# Altium schematic sheet power.SchDoc
size Tabloid; Author: Martin Lafleur; Organization: Opensolar; Address1: 125 Du Versant; Address2: Saint-Colomban; Address3: Québec, Canada; Address4: J5K 1L9; Website: www.opensolar.io; email: mlafleur@opensolar.io
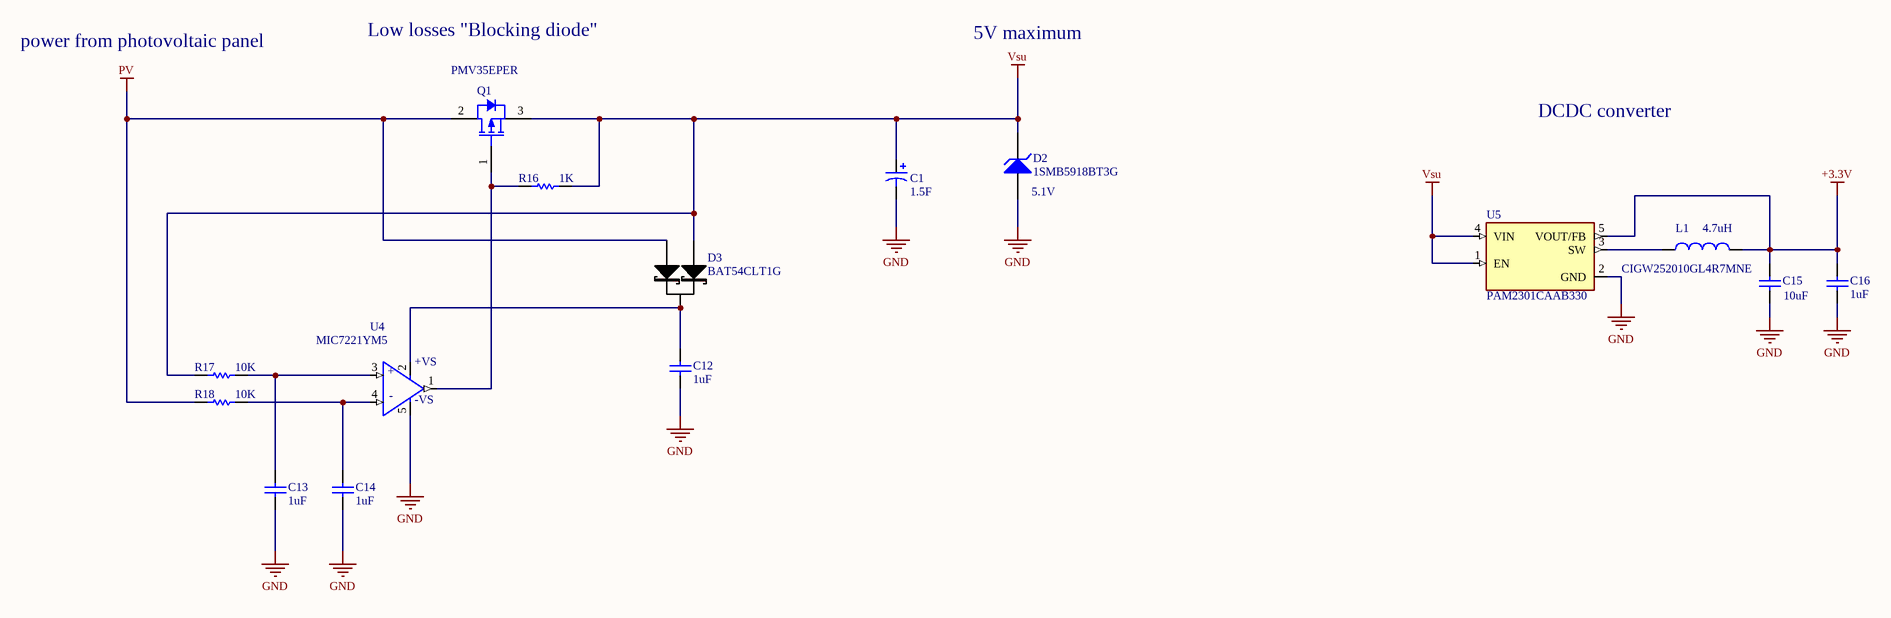
[diagram p0: power.SchDoc]

## Parts
C1  value 1.5F  [SCMR22H155PSBB0]  (hidden comment: Cap Pol1)
C12  1uF  [6-0805_M]
C13  1uF  [6-0805_M]
C14  1uF  [6-0805_M]
C15  10uF  [6-0805_M]
C16  1uF  [6-0805_M]
D2  1SMB5918BT3G  value 5.1V  [SMB]
D3  BAT54CLT1G  [SOT23-DUODIODE]
L1  CIGW252010GL4R7MNE  value 4.7uH  [INDUCTOR_2520 - duplicate1]
Q1  PMV35EPER  [PMV35EPER]
R16  1K  [6-0805_N]
R17  10K  [6-0805_N]
R18  10K  [6-0805_N]
U4  MIC7221YM5  [MIC7221YM5]
U5  PAM2301CAAB330  [SOT95P280X100-5N]

## Nets
+3.3V: C15.2 C16.2 L1.2 U5.5(VOUT/FB)
GND: C1.2 C12.1 C13.1 C14.1 C15.1 C16.1 D2.1(A) U4.5(-VS) U5.2(GND)
PV: D3.2 Q1.2(D) R18.1
Vsu: C1.1 D2.2(K) D3.1 Q1.3(S) R16.2 R17.1 U5.1(EN) U5.4(VIN)
NetC12_2: C12.2 D3.3 U4.2(+VS)
NetC13_2: C13.2 R17.2 U4.3(IN+)
NetC14_2: C14.2 R18.2 U4.4(IN-)
NetL1_1: L1.1 U5.3(SW)
NetQ1_1: Q1.1(G) R16.1 U4.1(OUT)

## Notes on the sheet
- power from photovoltaic panel
- Low losses "Blocking diode"
- 5V maximum
- DCDC converter
- Title
- Size:
- Date:
- Tabloid
- Author:
- Time:
- Revision:
- Sheet
- of
- File:
- (in symbol MIC7221YM5-TR) +; -

## Library data of the parts
C1 = Cap Pol1: Polarized Capacitor (Radial); Published: 8-Jun-2000; LatestRevisionDate: 17-Jul-2002; LatestRevisionNote: Re-released for DXP Platform.; PackageReference: RB7.6-15; Publisher: Altium Limited; PackageDescription: Polarized Capacitor (Radial); 2 Leads
C12-C14 = Cap: Capacitor; Published: 8-Jun-2000; LatestRevisionDate: 17-Jul-2002; LatestRevisionNote: Re-released for DXP Platform.; PackageReference: RAD-0.3; Publisher: Altium Limited; PackageDescription: Radial Cap, Thru-Hole; 2 Leads; 0.3 in Pin Spacing; Value: 1uF; jlc: C28323
C15 = Cap: Published: 8-Jun-2000; LatestRevisionDate: 17-Jul-2002; LatestRevisionNote: Re-released for DXP Platform.; PackageReference: RAD-0.3; Publisher: Altium Limited; PackageDescription: Radial Cap, Thru-Hole; 2 Leads; 0.3 in Pin Spacing; Value: 10uF; jlc: C15850
C16 = Cap: Capacitor; Value: 100nF; Published: 8-Jun-2000; LatestRevisionDate: 17-Jul-2002; LatestRevisionNote: Re-released for DXP Platform.; PackageReference: RAD-0.3; Publisher: Altium Limited; PackageDescription: Radial Cap, Thru-Hole; 2 Leads; 0.3 in Pin Spacing; jlc: C28323
D2 = D Zener: Zener Diode; Published: 8-Jun-2000; LatestRevisionDate: 17-Jul-2002; LatestRevisionNote: Re-released for DXP Platform.; PackageReference: DIODE-0.7; Publisher: Altium Limited; PackageDescription: Diode, Thru-Hole; 2 Leads; 0.7 in Pin Spacing; jlc: C142361
D3 = BAT54C-SOT23: DUAL SCHOTTKY DIODE COMMON CATHODE; Manufacturer: NXP Semiconductors; Manufacturer Part Number: BAT54C,215; Reverse Recovery Time (trr): 5ns; Current - Average Rectified (Io) (per Diode): 200mA (DC); Speed: Small Signal =< 200mA (Io), Any Speed; Diode Configuration: 1 Pair Common Cathode; Voltage - DC Reverse (Vr) (Max): 30V; Current - Reverse Leakage @ Vr: 2µA @ 25V; Voltage - Forward (Vf) (Max) @ If: 800mV @ 100mA; Supplier 1: Digi-Key; Supplier Part Number 1: 568-1612-1-ND; Package / Case: SOT-23-3, TO-236-3, Micro3™, SSD3, SST3; Packaging: Cut Tape (CT); Mounting Type: Surface Mount; Diode Type: Schottky; Category: Discrete Semiconductor Products; RoHS: RoHS Compliant; Supplier Part Number: 568-1612-1-ND; Supplier: Digi-Key; jlc: C14308
L1 = Inductor: Code_IEC: 1005; Published: 8-Jun-2000; LatestRevisionDate: 29-May-2009; LatestRevisionNote: IPC-7351 Footprint Added.; PackageReference: 0402-A; Publisher: Altium Limited; PackageDescription: Chip Inductor; Code_JEITA: 0402; jlc: C86070
Q1 = MOSFET-P: P-Channel MOSFET; Published: 8-Jun-2000; LatestRevisionDate: 17-Jul-2002; LatestRevisionNote: Re-released for DXP Platform.; PackageVersion: 1995/1996; PackageReference: E3; Publisher: Altium Limited; PackageDescription: TO, Flat Index; 3 In-Line, Axial Leads; Body Dia. 4.6mm; Lead Dia. 0.5 mm (max)
R16-R18 = Res1: Resistor; Published: 8-Jun-2000; LatestRevisionDate: 17-Jul-2002; LatestRevisionNote: Re-released for DXP Platform.; PackageReference: AXIAL-0.3; Publisher: Altium Limited; PackageDescription: Axial Device, Thru-Hole; 2 Leads; 0.3 in Pin Spacing
  R16: Value: 1K; jlc: C17513
  R17 R18: Value: 10K; jlc: C17414
U4 = MIC7221YM5-TR: Comparator General Purpose Open Drain SOT-23-5; MF: Microchip; Price: None; Availability: Unavailable; MP: MIC7221YM5-TR; Package: SOT-23 Microchip; SnapEDA_Link: https://www.snapeda.com/parts/MIC7221YM5-TR/Microchip/view-part/1222183/?ref=snap; Value: *
U5 = PAM2301CAAB120: Buck Switching Regulator IC Positive Fixed 1.2V 1 Output 800mA SOT-23-5 Thin, TSOT-23-5; MF: Diodes Inc.; SnapEDA_Link: https://www.snapeda.com/parts/PAM2301CAAB120/Diodes%20Inc./view-part/924331/?ref=snap; Availability: Unavailable; Value: *; Price: None; MP: PAM2301CAAB120; Package: SOT-23-5 Diodes Inc.; jlc: C9051